# Altium schematic sheet DA_TN.SchDoc
size A3
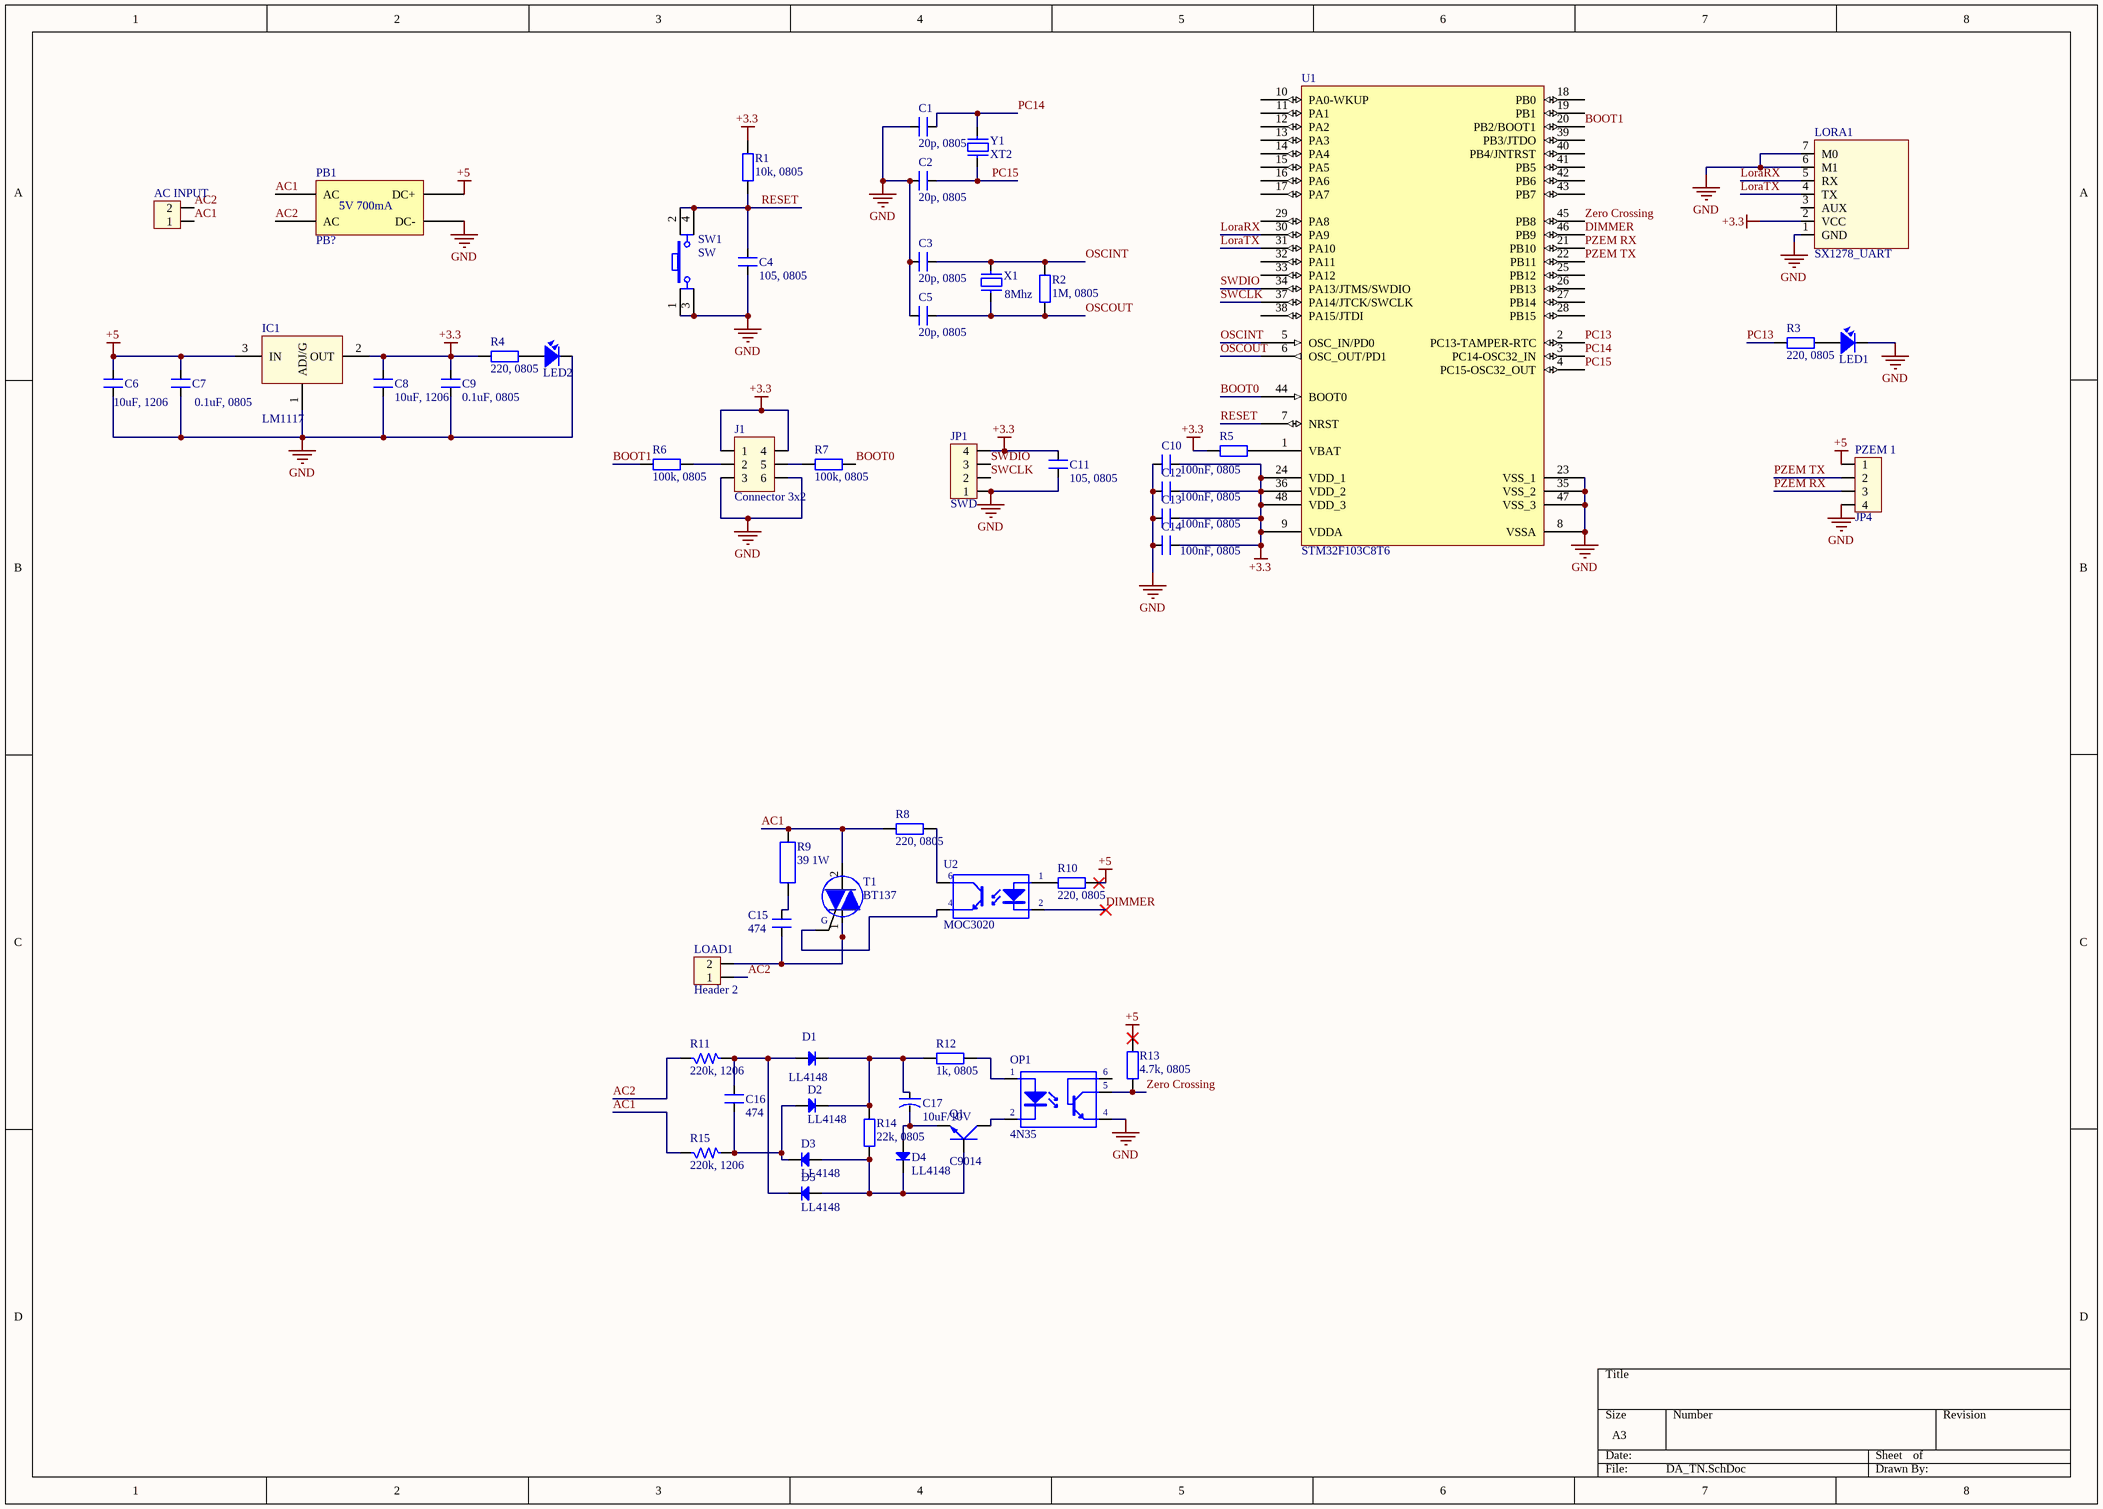
[diagram p0: DA_TN.SchDoc]

## Parts
AC_INPUT  AC INPUT  [HED2]  (value not drawn)
C1  20p, 0805  [SM-CAP-0805]
C2  20p, 0805  [SM-CAP-0805]
C3  20p, 0805  [SM-CAP-0805]
C4  105, 0805  [SM-CAP-0805]
C5  20p, 0805  [SM-CAP-0805]
C6  10uF, 1206  [SM-Cap-1206]
C7  0.1uF, 0805  [SM-CAP-0805]
C8  10uF, 1206  [SM-Cap-1206]
C9  0.1uF, 0805  [SM-CAP-0805]
C10  100nF, 0805  [SM-CAP-0805]
C11  105, 0805  [SM-CAP-0805]
C12  100nF, 0805  [SM-CAP-0805]
C13  100nF, 0805  [SM-CAP-0805]
C14  100nF, 0805  [SM-CAP-0805]
C15  474  [CN4]
C16  474  [CN4]
C17  10uF/10V  [CAP-ALU-SMD-4.5x5x1.4]
D1  LL4148  [DIO-SMD-4148]
D2  LL4148  [DIO-SMD-4148]
D3  LL4148  [DIO-SMD-4148]
D4  LL4148  [DIO-SMD-4148]
D5  LL4148  [DIO-SMD-4148]
IC1  LM1117  [SOT223-4N]
J1  Connector 3x2  [JP3x2]
JP1  SWD  [CON4]
LED1  LED SMD  [SM-LED-0805-Red]  (value not drawn)
LED2  LED SMD  [SM-LED-0805-Red]  (value not drawn)
LOAD1  Header 2  [HED2]
LORA1  SX1278_UART  [sx1278_UART]
OP1  4N35  [DIP6/W0.3]
PB1  PB?  [Module 5V700mA 5V AC*DC]
PZEM_1  JP4  [CON4]
Q1  C9014  [QTO-92]
R1  10k, 0805  [SM-RES-0805]
R2  1M, 0805  [SM-RES-0805]
R3  220, 0805  [SM-RES-0805]
R4  220, 0805  [SM-RES-0805]
R5  100k, 0805  [SM-RES-0805]  (value not drawn)
R6  100k, 0805  [SM-RES-0805]
R7  100k, 0805  [SM-RES-0805]
R8  220, 0805  [SM-RES-0805]
R9  39 1W  [R1W]
R10  220, 0805  [SM-RES-0805]
R11  220k, 1206  [SM-RES-1206]
R12  1k, 0805  [SM-RES-0805]
R13  4.7k, 0805  [SM-RES-0805]
R14  22k, 0805  [SM-RES-0805]
R15  220k, 1206  [SM-RES-1206]
SW1  SW  [SW4]
T1  BT137  [TO252-BCE]
U1  STM32F103C8T6  [LQFP48_M]
U2  MOC3020  [DIP6/W0.3]
X1  8Mhz  [XT2]
Y1  XT2  [XT32k]

## Nets
+3.3: C8.2 C9.2 C10.2 C11.2 C12.2 C13.2 C14.2 IC1.2(OUT) J1.1 J1.4 JP1.4 LORA1.2(VCC) R1.2 R4.1 R5.2 U1.9(VDDA) U1.24(VDD_1) U1.36(VDD_2) U1.48(VDD_3)
+5: C6.2 C7.2 IC1.3(IN) PB1.4(DC+) PZEM_1.1 R10.2 R13.1
GND: C1.1 C2.1 C3.1 C4.1 C5.1 C6.1 C7.1 C8.1 C9.1 C10.1 C11.1 C12.1 C13.1 C14.1 IC1.1(ADJ/G) J1.3 J1.6 JP1.1 LED1.2 LED2.2 LORA1.1(GND) LORA1.6(M1) LORA1.7(M0) OP1.4(E) PB1.3(DC-) PZEM_1.4 SW1.1 SW1.3 U1.8(VSSA) U1.23(VSS_1) U1.35(VSS_2) U1.47(VSS_3)
AC1: AC_INPUT.1 PB1.1(AC) R8.1 R9.2 R15.1 T1.2(MT2)
AC2: AC_INPUT.2 LOAD1.1 PB1.2(AC) R11.1
BOOT0: R7.1 U1.44(BOOT0)
BOOT1: R6.2 U1.20(PB2/BOOT1)
DIMMER: U1.46(PB9) U2.2(K)
LoraRX: LORA1.5(RX) U1.30(PA9)
LoraTX: LORA1.4(TX) U1.31(PA10)
OSCINT: C3.2 R2.2 U1.5(OSC_IN/PD0) X1.2
OSCOUT: C5.2 R2.1 U1.6(OSC_OUT/PD1) X1.1
PC13: R3.1 U1.2(PC13-TAMPER-RTC)
PC14: C1.2 U1.3(PC14-OSC32_IN) Y1.2
PC15: C2.2 U1.4(PC15-OSC32_OUT) Y1.1
PZEM RX: PZEM_1.3 U1.21(PB10)
PZEM TX: PZEM_1.2 U1.22(PB11)
RESET: C4.2 R1.1 SW1.2 SW1.4 U1.7(NRST)
SWCLK: JP1.2 U1.37(PA14/JTCK/SWCLK)
SWDIO: JP1.3 U1.34(PA13/JTMS/SWDIO)
Zero Crossing: OP1.5(C) R13.2 U1.45(PB8)
NetC15_1: C15.1 LOAD1.2 T1.1(MT1)
NetC15_2: C15.2 R9.1
NetC16_1: C16.1 D2.1(A) D3.2(K) R15.2
NetC16_2: C16.2 D1.1(A) D5.2(K) R11.2
NetC17_1: C17.1 D1.2(K) D2.2(K) R12.2 R14.1
NetC17_2: C17.2 D4.1(A) Q1.1(E)
NetD3_1: D3.1(A) D4.2(K) D5.1(A) Q1.2(B) R14.2
NetJ1_2: J1.2 R6.1
NetJ1_5: J1.5 R7.2
NetLED1_1: LED1.1 R3.2
NetLED2_1: LED2.1 R4.2
NetOP1_1: OP1.1(A) R12.1
NetOP1_2: OP1.2(K) Q1.3(C)
NetR5_1: R5.1 U1.1(VBAT)
NetR8_2: R8.2 U2.6(C)
NetR10_1: R10.1 U2.1(A)
NetT1_3: T1.3(IN) U2.4(E)

Not connected (* = marked no-connect by the designer): LORA1 3(AUX); OP1 6(C); U1 10(PA0-WKUP) 11(PA1) 12(PA2) 13(PA3) 14(PA4) 15(PA5) 16(PA6) 17(PA7) 18(PB0) 19(PB1) 25(PB12) 26(PB13) 27(PB14) 28(PB15) 29(PA8) 32(PA11) 33(PA12) 38(PA15/JTDI) 39(PB3/JTDO) 40(PB4/JNTRST) 41(PB5) 42(PB6) 43(PB7)

## Notes on the sheet
- (in symbol BT137) G
- (in symbol Module 5V 700mA AC-DC) 5V 700mA

## Library data of the parts
AC_INPUT LOAD1 = Hed2: Header 2 (Green); Value: Header 2
C1-C14 = CN: Value: 0,1uF/300V; Designed by: VanDungEvn
C15 C16 = CN4: Cap np W0.4; Value: 0.47uF
C17 = CN-ALU-SMD: Polarized Capacitor (Axial); Published: 8-Jun-2000; LatestRevisionDate: 17-Jul-2002; LatestRevisionNote: Re-released for DXP Platform.; PackageReference: POLAR0.8; Publisher: Altium Limited
D1-D5 = Diode SMD: STMICROELECTRONICS         1N5711            Small Signal Schottky Diode, Single, 70 V, 15 mA, 410 mV, 200 C; Revision: July-2002: Re-released for DXP Platform.
IC1 = LM1117: Available in 1.8V, 2.5V, 2.85V, 3.3V, 5V, and  Adjustable Versions; Value: LM317
J1 = JP3x2: Value: Connector 3x2
JP1 PZEM_1 = Con4: Connector 4; Value: Connector 4
LED1 LED2 = LED-SMD-0805
OP1 = 4N35: Opto; Value: 4N35
PB1 = Module 5V 700mA AC-DC
Q1 = NPN_EBC: P 600mW, EBC; Value: C9014
R1-R8 R10 R12-R14 = R1/4W: Resistor 1/4W; Value: R1/4W - 1K
R9 = R1W: Resistor 1W; Value: R1W - 100
R11 R15 = R: Resistor 1/4W; Value: R1/4W - 1K
SW1 = SW4: Switch button 4 pin; Value: Button chip 4 pin
T1 = BT137: NXP         BT137-600            Triac, 600 V, 5 W, 1.5 V, TO-220, 65 A
U1 = STM32F103C8T6: STM32 ARM-based 32-bit MCU with 64 Kbytes Flash, 48-pin LQFP, Industrial Temperature; Published: 30-May-2008; DatasheetVersion: rev6, Mar-2008; PackageVersion: Mar-2008; PackageReference: LQFP48; Publisher: Altium Limited; PackageDescription: 48-Pin Low-Profile Quad Flat Pack, 7 x 7 mm Body, 0.5 mm Pitch (LQFP48); ComponentLink1Description: Manufacturer Link; ComponentLink1URL: www.st.com/stm32; ComponentLink2Description: Datasheet; ComponentLink2URL: http://www.st.com/stonline/products/literature/ds/13587.pdf
U2 = MOC3021: Single Opto; Value: MOC3021
X1 = XT2: Crystal For all Crystal 2pin.; Value: 4Mhz
Y1 = XT2: 20MHz ±20ppm Crystal 18pF 40 Ohm -20°C ~ 70°C  Surface Mount HC49/US